# Altium schematic sheet GSM.SchDoc
size A4
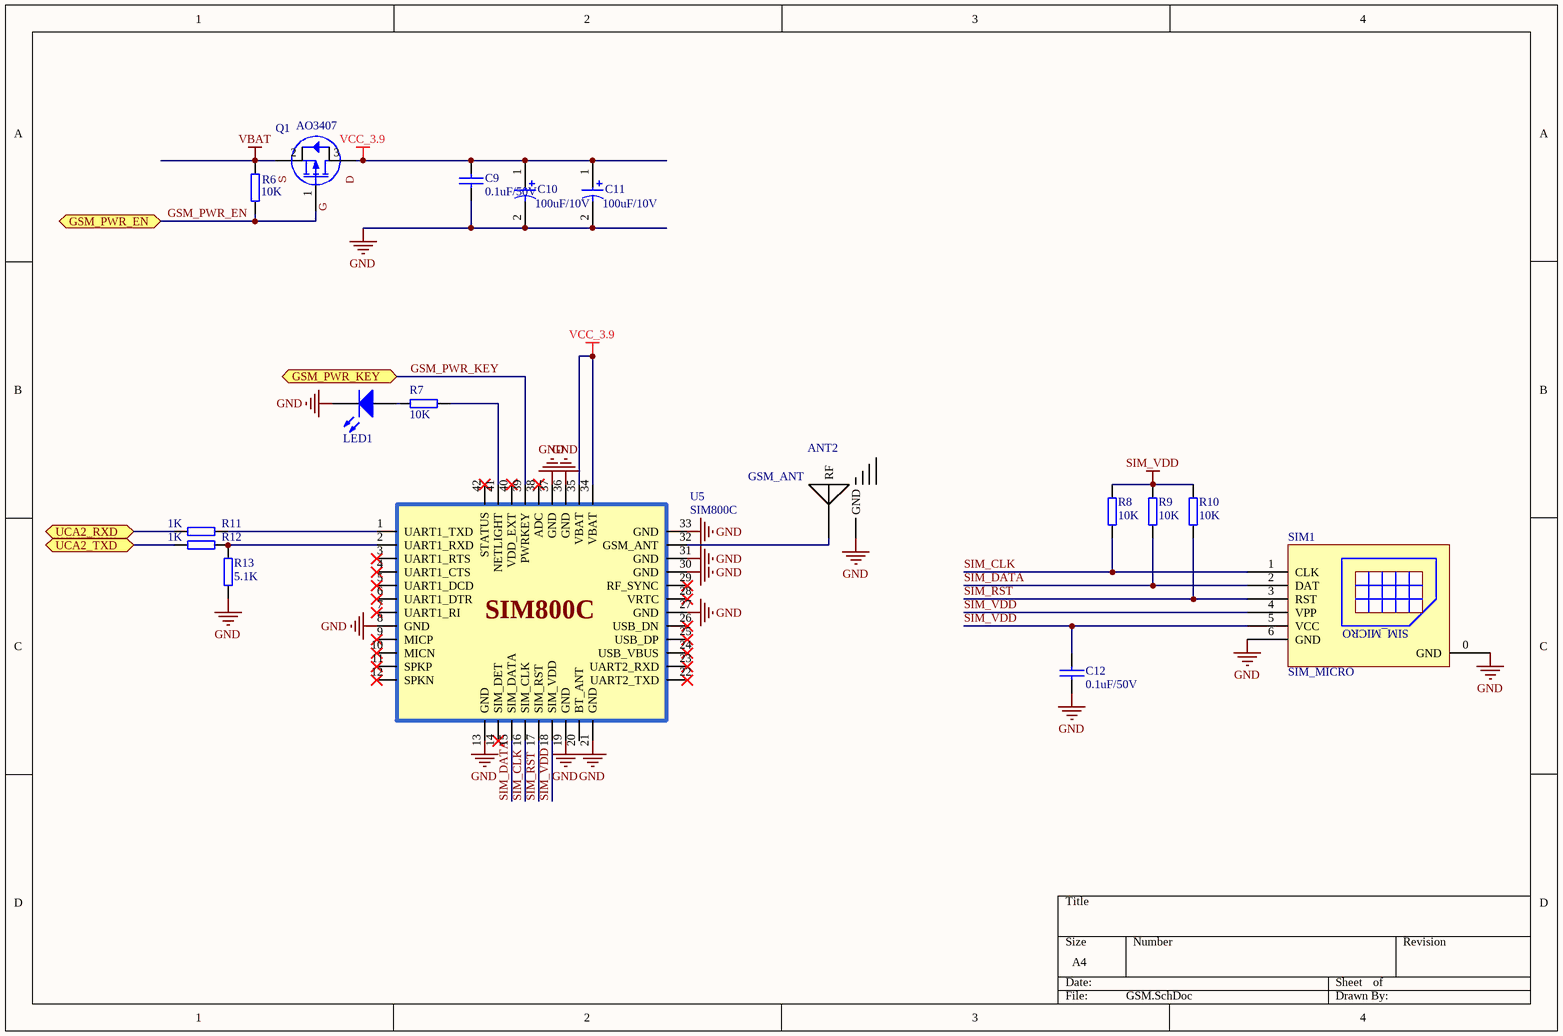
[diagram p0: GSM.SchDoc]

## Parts
ANT2  GSM_ANT  [IPEX]
C9  0.1uF/50V  [0603C]
C10  100uF/10V  [CAPTANC]
C11  100uF/10V  [CAPTANC]
C12  0.1uF/50V  [0603C]
LED1  YLED  [LED-0603]  (value not drawn)
Q1  AO3407  [SOT23]
R6  10K  [0603R]
R7  10K  [0603R]
R8  10K  [0603R]
R9  10K  [0603R]
R10  10K  [0603R]
R11  1K  [0603R]
R12  1K  [0603R]
R13  5.1K  [0603R]
SIM1  SIM_MICRO  [SIM_MICRO]
U5  SIM800C  [SIM800C]

## Ports
GSM_PWR_EN, GSM_PWR_KEY, UCA2_RXD, UCA2_TXD

## Nets
GND: ANT2.1(GND) C9.2 C10.2 C11.2 C12.2 LED1.2(K) R13.2 SIM1.0(GND) SIM1.6(GND) U5.8(GND) U5.13(GND) U5.19(GND) U5.21(GND) U5.27(GND) U5.30(GND) U5.31(GND) U5.33(GND) U5.36(GND) U5.37(GND)
SIM_VDD: C12.1 R8.1 R9.1 R10.1 SIM1.4(VPP) SIM1.5(VCC) U5.18(SIM_VDD)
VBAT: Q1.2(S) R6.1
VCC_3.9: C9.1 C10.1 C11.1 Q1.3(D) U5.34(VBAT) U5.35(VBAT)
GSM_PWR_EN: Q1.1(G) R6.2 ; port GSM_PWR_EN
GSM_PWR_KEY: U5.39(PWRKEY) ; port GSM_PWR_KEY
SIM_CLK: R8.2 SIM1.1(CLK) U5.16(SIM_CLK)
SIM_DATA: R9.2 SIM1.2(DAT) U5.15(SIM_DATA)
SIM_RST: R10.2 SIM1.3(RST) U5.17(SIM_RST)
UCA2_RXD: R11.1 ; port UCA2_RXD
UCA2_TXD: R12.1 ; port UCA2_TXD
NetANT2_2: ANT2.2(RF) U5.32(GSM_ANT)
NetLED1_1: LED1.1(A) R7.2
NetR7_1: R7.1 U5.41(NETLIGHT)
NetR11_2: R11.2 U5.1(UART1_TXD)
NetR12_2: R12.2 R13.1 U5.2(UART1_RXD)

Not connected (* = marked no-connect by the designer): U5 3(UART1_RTS)* 4(UART1_CTS)* 5(UART1_DCD)* 6(UART1_DTR)* 7(UART1_RI)* 9(MICP)* 10(MICN)* 11(SPKP)* 12(SPKN)* 14(SIM_DET)* 20(BT_ANT) 22(UART2_TXD)* 23(UART2_RXD)* 24(USB_VBUS)* 25(USB_DP)* 26(USB_DN)* 28(VRTC)* 29(RF_SYNC)* 38(ADC)* 40(VDD_EXT)* 42(STATUS)*

## Library data of the parts
ANT2 = GSM_ANT_1: passive_antenna
C9 = CAP: Capacitor
C10 C11 = CAP2
C12 = 0603C
LED1 = LED3: BLUE LED; Published: 8-Jun-2000; LatestRevisionDate: 17-Dec-2003; LatestRevisionNote: PCB Footprint replaced.; DatasheetDocument: 16-Apr-2002; PackageDocument: 16-Apr-2002; PackageReference: 3.5X2.8X1.9; Publisher: Altium Limited
Q1 = AO3401: P-Channel MOSFET; Published: 8-Jun-2000; LatestRevisionDate: 17-Jul-2002; LatestRevisionNote: Re-released for DXP Platform.; PackageVersion: 1995/1996; PackageReference: E3; Publisher: Altium Limited; PackageDescription: TO, Flat Index; 3 In-Line, Axial Leads; Body Dia. 4.6mm; Lead Dia. 0.5 mm (max)
R6-R13 = RES2A